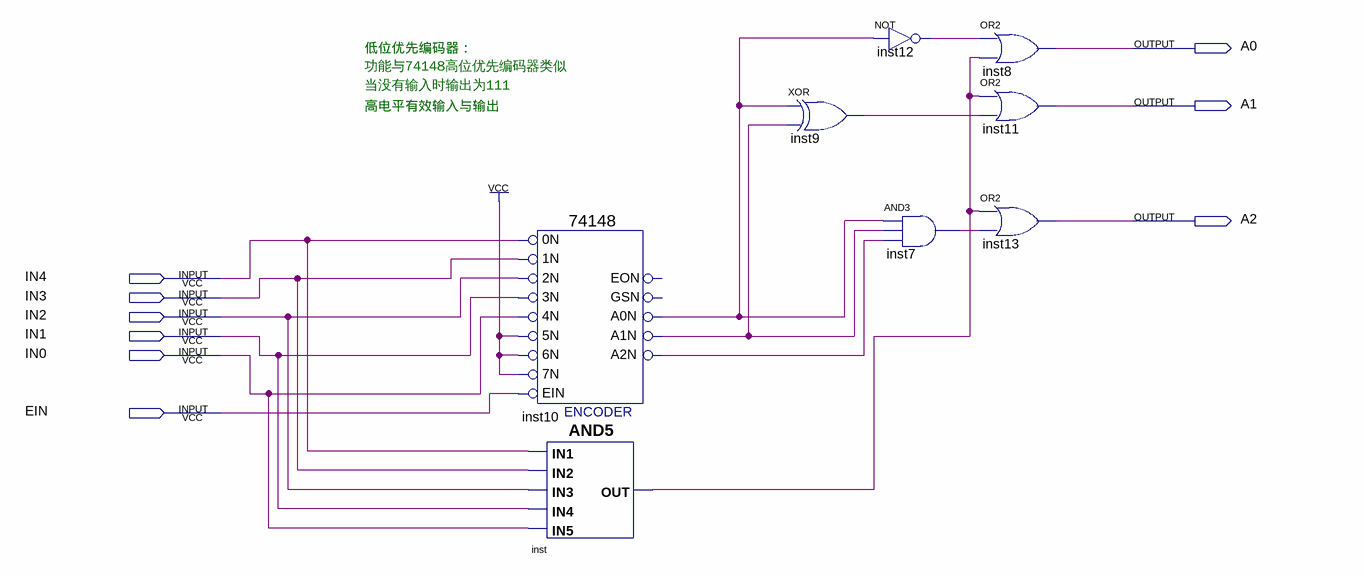
[diagram p0: schematic sheet]
// Quartus schematic ENCODE_LF.bdf as structural Verilog: 8 symbols, 9 pins
module ENCODE_LF (
  input  IN4,
  input  IN3,
  input  IN2,
  input  IN1,
  input  IN0,
  input  EIN,
  output A0,
  output A1,
  output A2
);

  wire inst7_out, inst9_out, inst10_a0n, inst10_a1n, inst10_a2n, inst12_out, inst_out;

  \74148  inst10 (
    .\5N (1'b1), .\0N (IN4), .\1N (IN3), .\2N (IN2), .\3N (IN1), .\4N (IN0), .EIN(EIN), .\6N (1'b1),
    .\7N (1'b1), .A1N(inst10_a1n), .A0N(inst10_a0n), .A2N(inst10_a2n));  // open: EON, GSN
  and inst (inst_out, IN4, IN3, IN2, IN1, IN0);
  xor inst9 (inst9_out, inst10_a0n, inst10_a1n);
  not inst12 (inst12_out, inst10_a0n);
  and inst7 (inst7_out, inst10_a0n, inst10_a1n, inst10_a2n);
  or inst8 (A0, inst12_out, inst_out);
  or inst11 (A1, inst_out, inst9_out);
  or inst13 (A2, inst_out, inst7_out);

  // Notes on the sheet:
  //   低位优先编码器：
  //   功能与74148高位优先编码器类似
  //   当没有输入时输出为111
  //   高电平有效输入与输出
endmodule
